# Altium schematic sheet MOTOR.SchDoc
size 558 x 431 mm; Engineer: Nicholas Oborny; Revision: A.1; Name: Nicholas Oborny; Start Date: 7/23/2012
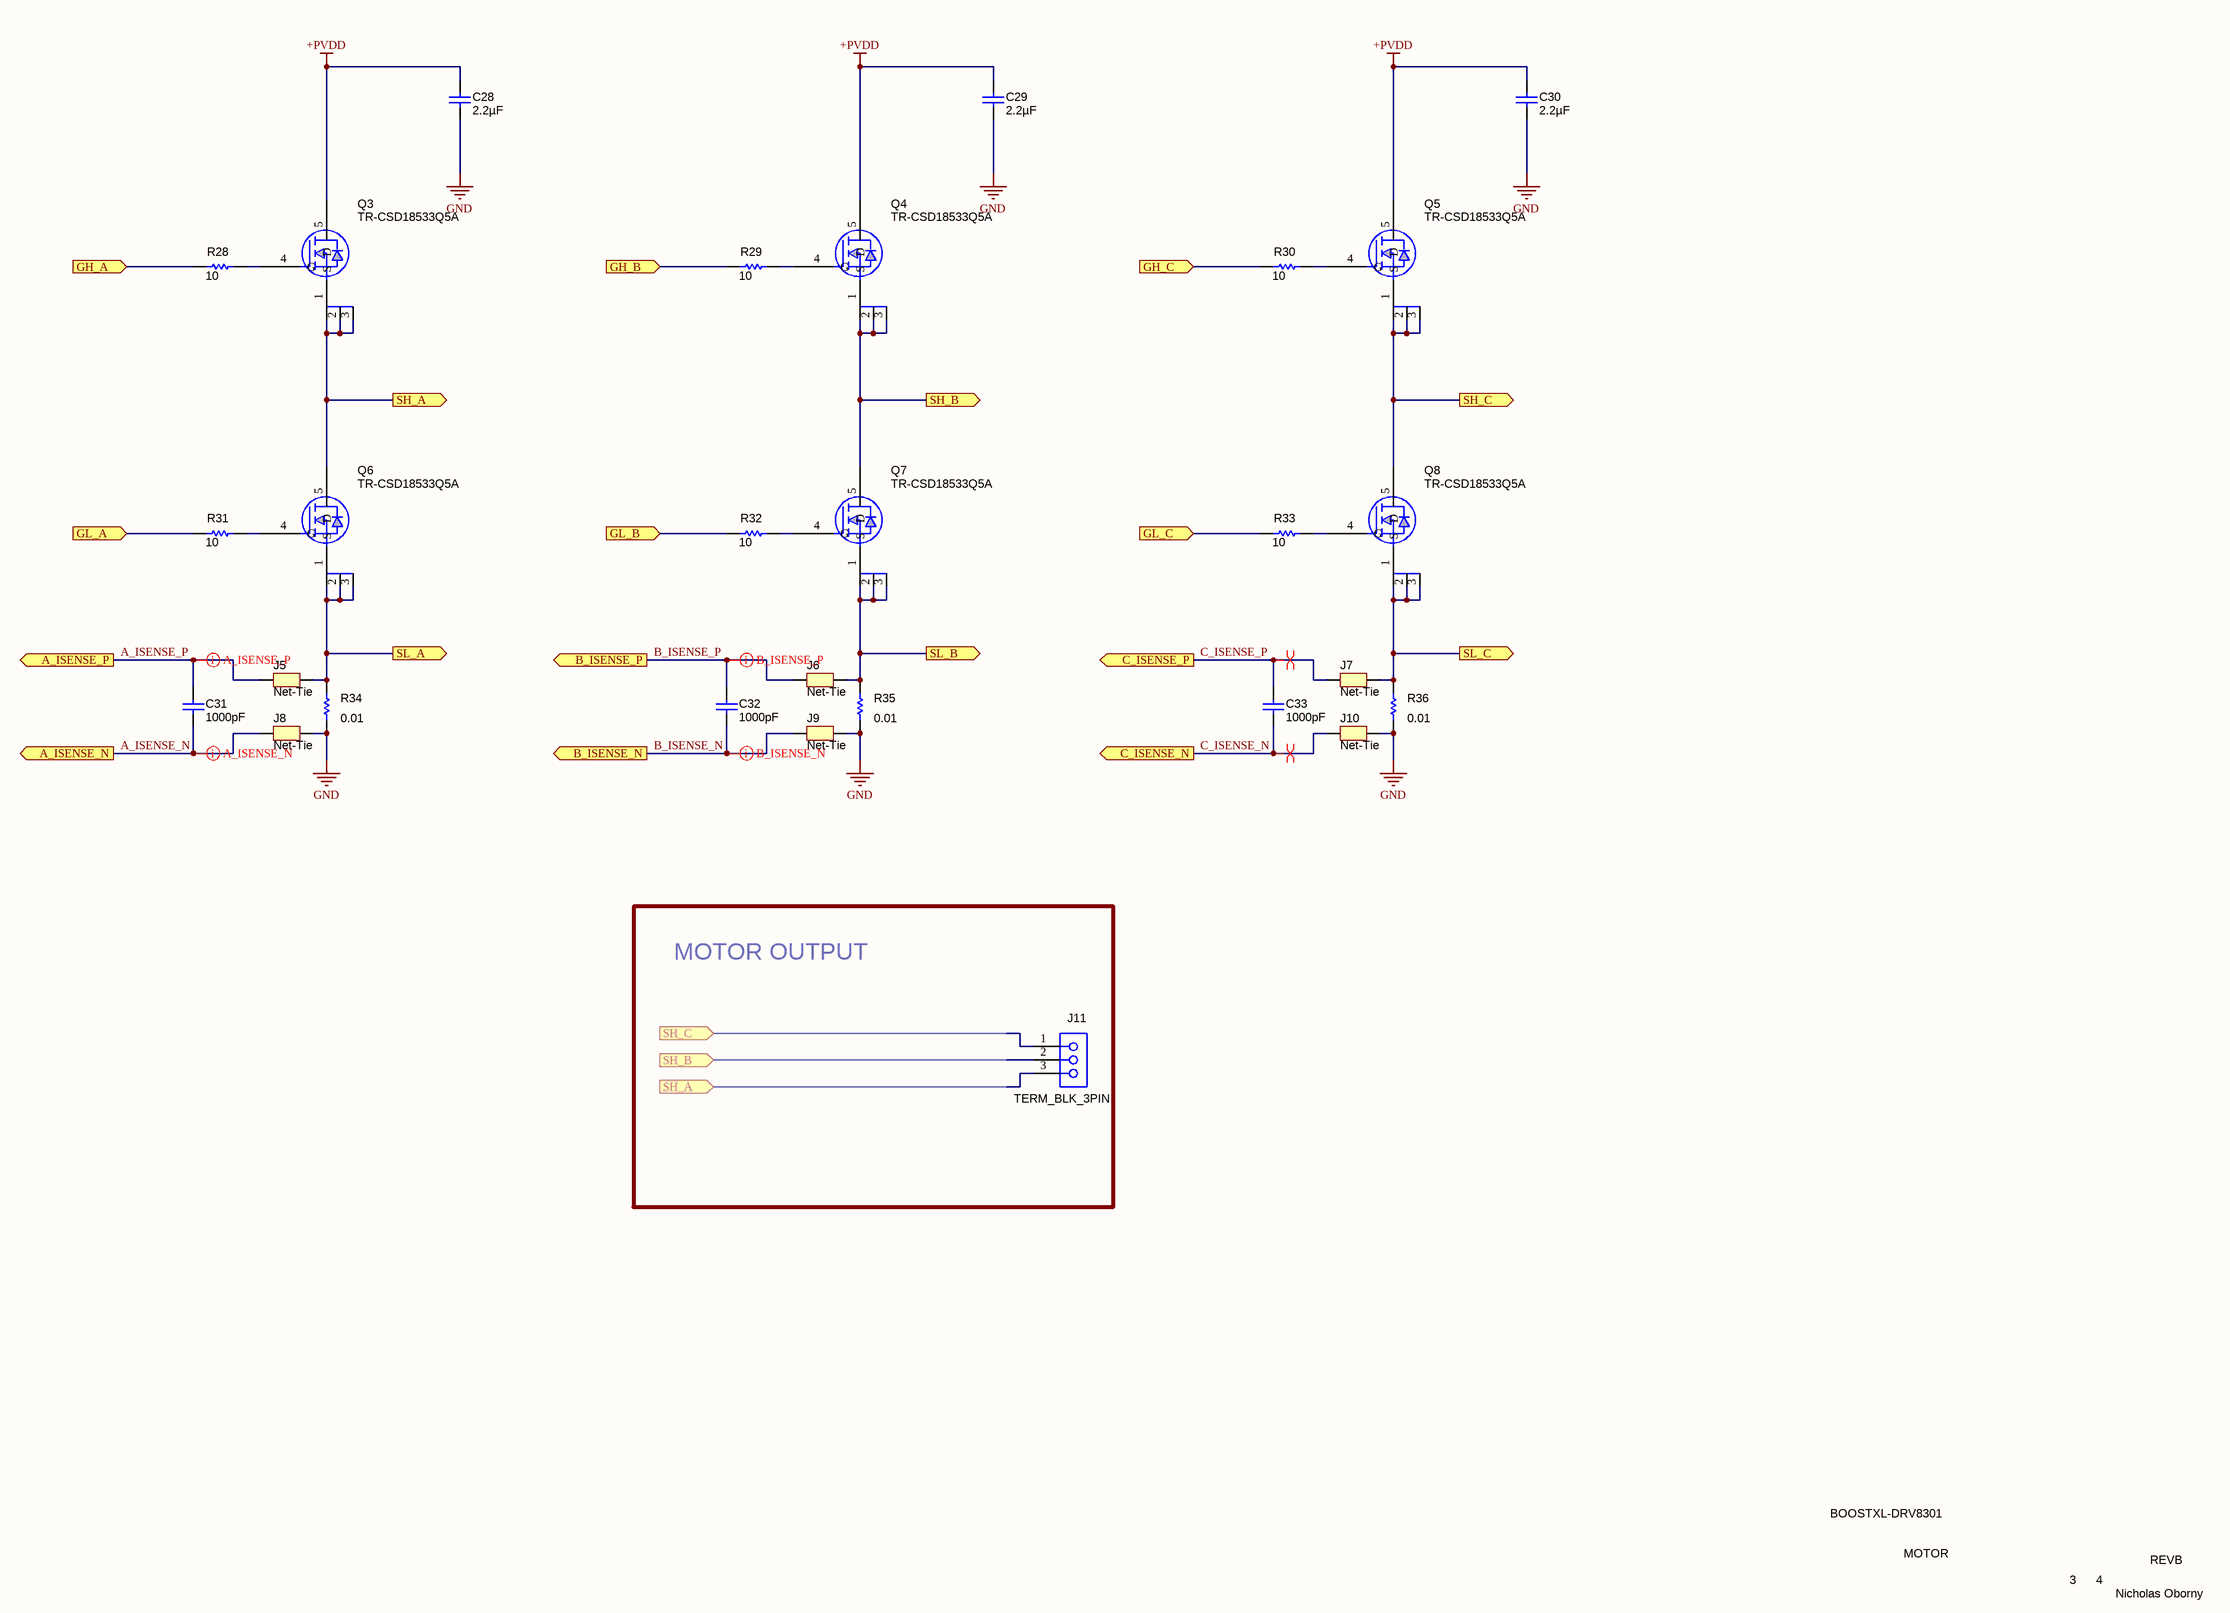
[diagram p0: MOTOR.SchDoc]

## Parts
C28  ValueDisplayed: 2.2µF  [1210L]  (hidden comment: GRM32ER72A225KA35L)
C29  ValueDisplayed: 2.2µF  [1210L]  (hidden comment: GRM32ER72A225KA35L)
C30  ValueDisplayed: 2.2µF  [1210L]  (hidden comment: GRM32ER72A225KA35L)
C31  ValueDisplayed: 1000pF  [0603]  (hidden comment: C0603C102J5GAC)
C32  ValueDisplayed: 1000pF  [0603]  (hidden comment: C0603C102J5GAC)
C33  ValueDisplayed: 1000pF  [0603]  (hidden comment: C0603C102J5GAC)
J5  Net-Tie  [Net-Tie_10mil]  (net tie, no BOM)
J6  Net-Tie  [Net-Tie_10mil]  (net tie, no BOM)
J7  Net-Tie  [Net-Tie_10mil]  (net tie, no BOM)
J8  Net-Tie  [Net-Tie_10mil]  (net tie, no BOM)
J9  Net-Tie  [Net-Tie_10mil]  (net tie, no BOM)
J10  Net-Tie  [Net-Tie_10mil]  (net tie, no BOM)
J11  TERM_BLK_3PIN  [CONN_ED120_3DS]
Q3  TR-CSD18533Q5A  [QFN5X6MM]
Q4  TR-CSD18533Q5A  [QFN5X6MM]
Q5  TR-CSD18533Q5A  [QFN5X6MM]
Q6  TR-CSD18533Q5A  [QFN5X6MM]
Q7  TR-CSD18533Q5A  [QFN5X6MM]
Q8  TR-CSD18533Q5A  [QFN5X6MM]
R28  value 10  [0603L]  (hidden comment: CRCW060310R0JNEA)
R29  value 10  [0603L]  (hidden comment: CRCW060310R0JNEA)
R30  value 10  [0603L]  (hidden comment: CRCW060310R0JNEA)
R31  value 10  [0603L]  (hidden comment: CRCW060310R0JNEA)
R32  value 10  [0603L]  (hidden comment: CRCW060310R0JNEA)
R33  value 10  [0603L]  (hidden comment: CRCW060310R0JNEA)
R34  value 0.01  [2512M]  (hidden comment: CRA2512-FZ-R010ELF)
R35  value 0.01  [2512M]  (hidden comment: CRA2512-FZ-R010ELF)
R36  value 0.01  [2512M]  (hidden comment: CRA2512-FZ-R010ELF)

## Blocks framed on the sheet
MOTOR OUTPUT: J11

## Ports
A_ISENSE_N, A_ISENSE_P, B_ISENSE_N, B_ISENSE_P, C_ISENSE_N, C_ISENSE_P, GH_A, GH_B, GH_C, GL_A, GL_B, GL_C, SH_A, SH_B, SH_C, SL_A, SL_B, SL_C

## Nets
+PVDD: C28.1 C29.1 C30.1 Q3.5(D) Q4.5(D) Q5.5(D)
GND: C28.2 C29.2 C30.2 J8.1 J9.1 J10.1 R34.1 R35.1 R36.1
A_ISENSE_N: C31.2 J8.2 ; port A_ISENSE_N
A_ISENSE_P: C31.1 J5.2 ; port A_ISENSE_P
B_ISENSE_N: C32.2 J9.2 ; port B_ISENSE_N
B_ISENSE_P: C32.1 J6.2 ; port B_ISENSE_P
C_ISENSE_N: C33.2 J10.2 ; port C_ISENSE_N
C_ISENSE_P: C33.1 J7.2 ; port C_ISENSE_P
GH_A: R28.1 ; port GH_A
GH_B: R29.1 ; port GH_B
GH_C: R30.1 ; port GH_C
GL_A: R31.1 ; port GL_A
GL_B: R32.1 ; port GL_B
GL_C: R33.1 ; port GL_C
SH_A: J11.3 Q3.1(S) Q3.2 Q3.3 Q6.5(D) ; port SH_A
SH_B: J11.2 Q4.1(S) Q4.2 Q4.3 Q7.5(D) ; port SH_B
SH_C: J11.1 Q5.1(S) Q5.2 Q5.3 Q8.5(D) ; port SH_C
SL_A: J5.1 Q6.1(S) Q6.2 Q6.3 R34.2 ; port SL_A
SL_B: J6.1 Q7.1(S) Q7.2 Q7.3 R35.2 ; port SL_B
SL_C: J7.1 Q8.1(S) Q8.2 Q8.3 R36.2 ; port SL_C
NetQ3_4: Q3.4(G) R28.2
NetQ4_4: Q4.4(G) R29.2
NetQ5_4: Q5.4(G) R30.2
NetQ6_4: Q6.4(G) R31.2
NetQ7_4: Q7.4(G) R32.2
NetQ8_4: Q8.4(G) R33.2

## Layout directives
differential pair: A_ISENSE_N, A_ISENSE_P, B_ISENSE_N, B_ISENSE_P, C_ISENSE_N, C_ISENSE_P

## Notes on the sheet
- BOOSTXL-DRV8301
- MOTOR
- 3
- 4
- REVB
- Nicholas Oborny

## Library data of the parts
C28-C30 = GRM32ER72A225KA35L: CAP, CERM, 2.2uF, 100V, +/-10%, X7R, 1210; Manufacturer: MuRata; Polarized: N; CompType: Capacitor; U/M: EA; Cap_F: 0.0000022; Tolerance_%: 10; ESR_Ohm: 0.007; Value1: 0.007 ohm; VDC_V: 100; IRMS_A: 4.4; TaMin_C: -55; TaMax_C: 125; Cap_Case: 1210; SymbolVersion: 2008-07-09; Value: 2.2uF; PartNumber: GRM32ER72A225KA35L; PackageReference: 1210; RoHS: Y; Value2: 100V; MountType: SMT; Technology: Ceramic; TempCo: X7R; Published: 2008-06-19; Publisher: Texas Instruments; LatestRevisionDate: 2013-05-24; LatestRevisionNote: Changed publisher; ComponentLink1Description: Datasheet link; ComponentLink1URL: http://search.murata.co.jp/Ceramy/PnsearchViewAction.do?HnOFG=ON&HnNFG=ON&SEL_CNT=50&sLang=en&sKey=GRM32ER72A225KA35L&x=9&y=9&search=startwith; Supplier 1: Digi-Key; Supplier Part Number 1: 490-3385-1-ND; Supplier 2: Mouser; Supplier Part Number 2: 81-GRM32ER72A225KA35; Supplier 3: Farnell; Supplier Part Number 3: 1735547
C31-C33 = C0603C102J5GAC: CAP, CERM, 1000pF, 50V, +/-5%, C0G/NP0, 0603; Manufacturer: Kemet; Polarized: N; CompType: Capacitor; U/M: EA; Cap_F: 0.000000001; Tolerance_%: 5; Value1: Unknown; VDC_V: 50; TaMin_C: -55; TaMax_C: 125; SymbolVersion: 2008-07-09; Value: 1000pF; PartNumber: C0603C102J5GAC; PackageReference: 0603; RoHS: Y; Value2: 50V; MountType: SMT; Technology: Ceramic; TempCo: C0G/NP0; Cap_Case: 0603; Published: 2008-06-19; Publisher: Texas Instruments; LatestRevisionDate: 2013-05-24; LatestRevisionNote: Changed publisher; ComponentLink1Description: Datasheet link; ComponentLink1URL: http://www.kemet.com/kemet/web/homepage/kechome.nsf/vapubfiles/F3102_Y5V.pdf/$file/F3102_Y5V.pdf; Supplier 1: Farnell; Supplier Part Number 1: 317202
J5-J10 = Net-Tie: Single point connection between nets.; SymbolCreator: codlsc; SymbolVersion: 2009-07-01; MountType: SMT; Publisher: Texas Instruments; LatestRevisionDate: 2013-05-15; LatestRevisionNote: Added Alternate PartNumber and Alternate Manufacturer parameters to appropriate components.
J11 = ED120/3DS: TERMINAL BLOCK 5.08MM VERT 3POS; PartNumber: OSTTA034163; Manufacturer: On-Shore Technology; SymbolCreator: a0412235; U/M: EA; Value: 3 Pin Header; SymbolVersion: 2013-02-28; CompType: Terminal Block; RoHS: Y; PackageReference: TERM_BLK, 3pos, 5.08mm; MountType: TH; Publisher: Texas Instruments; LatestRevisionDate: 2013-06-04; Supplier 1: Digi-Key; Supplier Part Number 1: ED2581-ND
Q3-Q8 = TR-CSD18533Q5A: MOSFET, N-Chan, 60V, 18A, 6.1 mOhm; Manufacturer: TI; Area: 86800; SymbolVersion: 04/25/2012 11:24:36; PartNumber: CSD18533Q5A; ComponentLink1URL: \\vette02\pmp_pcb\pcad_pdf's\CSD18533Q5A.pdf; PackageReference: QFN-8 POWER; Value: CSD18533Q5A; ComponentHeight: *; ComponentLink1Description: AEO Datasheet Link
R28-R33 = CRCW060310R0JNEA: RES, 10 ohm, 5%, 0.1W, 0603; Manufacturer: Vishay-Dale; CompType: Resistor; Value_Code: 10R0; Tolerance_%: 5; Power_W: 0.1; VDC_V: 75; TempCo: 200 ppm/C; EIA_Code: E24; U/M: EA; SymbolVersion: 2009-05-29; PartNumber: CRCW060310R0JNEA; PackageReference: 0603; RoHS: Y; Res_ohm: 10; Value1: 5%; Value2: 0.1W; MountType: SMT; Technology: Thick Film; Published: 2008-06-26; Publisher: Texas Instruments; LatestRevisionDate: 2013-01-08; ComponentLink1Description: Datasheet link; ComponentLink1URL: http://www.vishay.com/docs/20035/dcrcwe3.pdf; Supplier 1: Digi-Key; Supplier Part Number 1: 541-10GCT-ND; Supplier 2: Mouser; Supplier Part Number 2: 71-CRCW0603J-10-E3; Supplier 3: Farnell; Supplier Part Number 3: 1514712
R34-R36 = CRA2512-FZ-R010ELF: RES, 0.01 ohm, 1%, 3W, 2512; Manufacturer: Bourns; CompType: Resistor; Value_Code: R010; Tolerance_%: 1; Power_W: 3; TempCo: 75 ppm/C; EIA_Code: E96; U/M: EA; SymbolVersion: 2009-05-29; PartNumber: CRA2512-FZ-R010ELF; PackageReference: 2512; RoHS: Y; Res_ohm: 0.01; Value1: 1%; Value2: 3W; MountType: SMT; Technology: Metal Film; Published: 2008-06-26; Publisher: Texas Instruments; LatestRevisionDate: 2013-05-25; ComponentLink1Description: Datasheet link; ComponentLink1URL: http://www.bourns.com/data/global/pdfs/CRA.pdf; Supplier 1: Digi-Key; Supplier Part Number 1: CRA2512-FZ-R010ELFCT-ND; Supplier 2: Mouser; Supplier Part Number 2: 652-CRA2512FZR010ELF; Supplier 3: Farnell; Supplier Part Number 3: 1435947